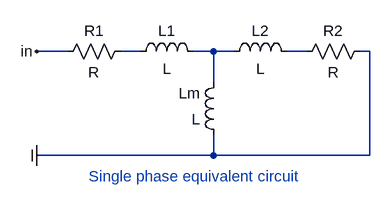
[diagram p0: schematic 3fmot_eq_cir.asc]
3fmot_eq_cir.asc, the LTspice schematic file:
Version 4
SHEET 1 880 680
WIRE -96 112 -144 112
WIRE 16 112 -16 112
WIRE 128 112 96 112
WIRE 128 160 128 112
WIRE 128 272 -144 272
WIRE 128 272 128 240
WIRE 160 112 128 112
WIRE 272 112 240 112
WIRE 368 112 352 112
WIRE 368 272 128 272
WIRE 368 272 368 112
FLAG -144 112 in
FLAG -144 272 COM
SYMBOL res 0 96 R90
WINDOW 0 0 56 VBottom 0
WINDOW 3 32 56 VTop 0
SYMATTR InstName R1
SYMBOL res 368 96 R90
WINDOW 0 0 56 VBottom 0
WINDOW 3 32 56 VTop 0
SYMATTR InstName R2
SYMBOL ind 0 128 R270
WINDOW 0 32 56 VTop 0
WINDOW 3 5 56 VBottom 0
SYMATTR InstName L1
SYMBOL ind 144 128 R270
WINDOW 0 32 56 VTop 0
WINDOW 3 5 56 VBottom 0
SYMATTR InstName L2
SYMBOL ind 144 256 R180
WINDOW 0 36 80 Left 0
WINDOW 3 36 40 Left 0
SYMATTR InstName Lm
TEXT -64 304 Left 0 ;Single phase equivalent circuit

The netlist it stands for:
* 3fmot_eq_cir.asc
R1 N001 in R
R2 COM N003 R
L1 N001 N002 L
L2 N002 N003 L
Lm COM N002 L
* Single phase equivalent circuit
.backanno
.end